# Altium schematic sheet OpAmp.SchDoc: Наименование
size 209 x 297 mm; ApprovedBy: Утвердил; CheckedBy: Проверил; Author: Разработал; CompanyName: Организация; DrawnBy: Н.Контр; Engineer: Т.Контр; SheetNumber: 1; SheetTotal: 1; PageSetup: Record=PageOptions|CenterHorizontal=True|CenterVertical=True|PrintScale=0.94|XCorrection=1.00|YCorrection=1.00|PrintKind=1|BorderSize=5000000|LeftOffset=0|BottomOffset=0|Orientation=1|PaperLength=1000|PaperWidth=1000|Scale=100|PaperSource=7|PrintQuality=-4|MediaType=1|DitherType=10|PaperKind=A4|PrintScaleMode=1; DecimalNumber: OpAmp; HeadOfSector: Нач. сектора; MainDevice: Перв.примен.; Name: Наименование; DocumentName: Sheet1.SCHDOC
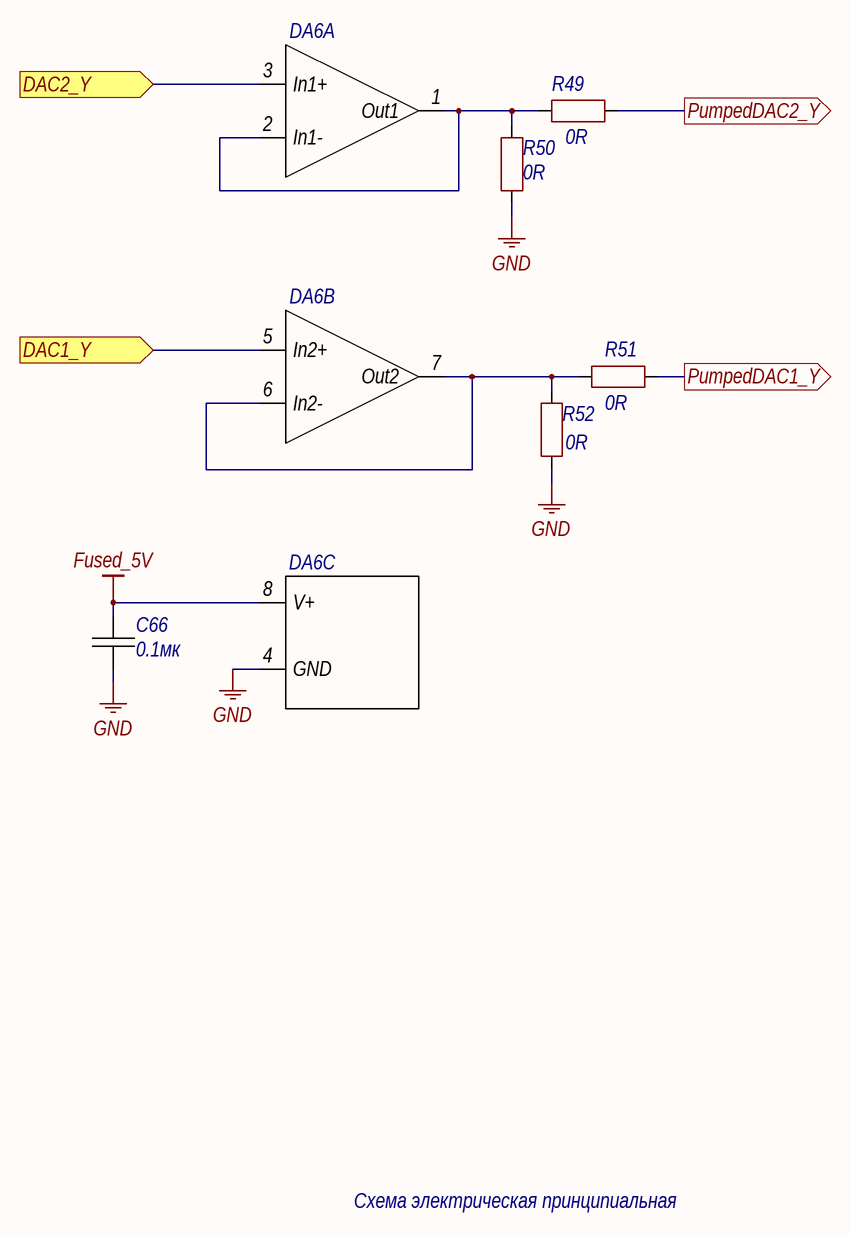
[diagram p0: OpAmp.SchDoc]

## Parts
C66  value 0.1мк  [CAP0402]  (hidden comment: 0.1мк 50V)
DA6  AD8032ARZ  [SOIC-8_M]  (value not drawn)  (parts A,B,C of 3)
R49  0R  [RESC0402(1005)_M]
R50  0R  [RESC0402(1005)_M]
R51  0R  [RESC0402(1005)_M]
R52  0R  [RESC0402(1005)_M]

## Ports
DAC1_Y (in), DAC2_Y (in), PumpedDAC1_Y (out), PumpedDAC2_Y (out)

## Nets
Fused_5V: C66.2 DA6.8(V+)
GND: C66.1 DA6.4(GND) R50.1 R52.1
DAC1_Y: DA6.5(In2+) ; port DAC1_Y
DAC2_Y: DA6.3(In1+) ; port DAC2_Y
PumpedDAC1_Y: R51.1 ; port PumpedDAC1_Y
PumpedDAC2_Y: R49.1 ; port PumpedDAC2_Y
NetDA6_1: DA6.1(Out1) DA6.2(In1-) R49.2 R50.2
NetDA6_6: DA6.6(In2-) DA6.7(Out2) R51.2 R52.2

## Notes on the sheet
- Схема электрическая принципиальная
- Подп. и дата
- Инв.№ дубл.
- Взам.инв.№
- Подп.и дата
- Инв.№ подл.
- Изм.
- Лист
- № докум.
- Подп.
- Дата
- Формат  A4

## Library data of the parts
C66 = CAP0402: Manufacturer: Samsung Electro-Mechanics; ManufacturerAlt: JLCPCB; MPN: CL05B104KB54PNC; MPNAlt: C307331; MntType: SMD; Notes: Basic Part; Tolerance: 10%; Height: 0.5mm; MSL: MSL 1; Package: =Footprint; RoHS: Comply; Weight: 1.500mg; PartType: CHIP CERAMIC CAPACITOR; Pins: 2; BOMDescription: =MntType+' '+PartType+' '+Package+' '+Value+' '+Tolerance+' '+Voltage+' '+TempCoeff+' '+MPN; CFootprint: =Footprint; Voltage: 50V; Part Number: CAP0402; ClassName: Capacitor; ComponentLink1Description: Datasheet; ComponentLink1Description: New link; ComponentLink1URL: https://datasheet.lcsc.com/lcsc/1810191222_Samsung-Electro-Mechanics-CL05B104KB54PNC_C307331.pdf
DA6 = AD8032ARZ: Manufacturer: AD; MntType: SMD; MPN: AD8032ARZ; Part Number: AD8032ARZ; MSL: MSL 1; Package: SOIC-8; RoHS: Cpmply; PartType: Amplifier; Pins: 8; BOMDescription: =MntType+' '+PartType+' '+Package+' '+Value+' '+Tolerance+' '+Voltage+' '+TempCoeff+' '+MPN; CFootprint: =Footprint; ClassName: Amplifier; ComponentLink1Description: Datasheet; ComponentLink1URL: https://eu.mouser.com/datasheet/2/609/AD8031_8032-1502047.pdf
R49-R52 = RES0402: MntType: SMD; MSL: MSL 1; Package: =Footprint; RoHS: Comply; PartType: CHIP RESISTOR; Pins: 2; BOMDescription: =MntType+' '+PartType+' '+Package+' '+Value+' '+Tolerance+' '+Voltage+' '+TempCoeff+' '+MPN; CFootprint: =Footprint; Value: 0R; Part Number: RES0402; ClassName: Resistor; ComponentLink1Description: Datasheet